# EasyEDA Pro project ProPrj_5VBuck_MP2236_2024-12-14.epro

# Schematic 5VBuck_MP2236
Board Name: Board1; Create Date: 2024-12-13; Page Name: 5VBuck_MP2236_P1; Project Name: 5VBuck_MP2236; Schematic Name: 5VBuck_MP2236; Update Date: 2024-12-13; Company: 嘉立创EDA; Page Size: A4; Version: V1.0
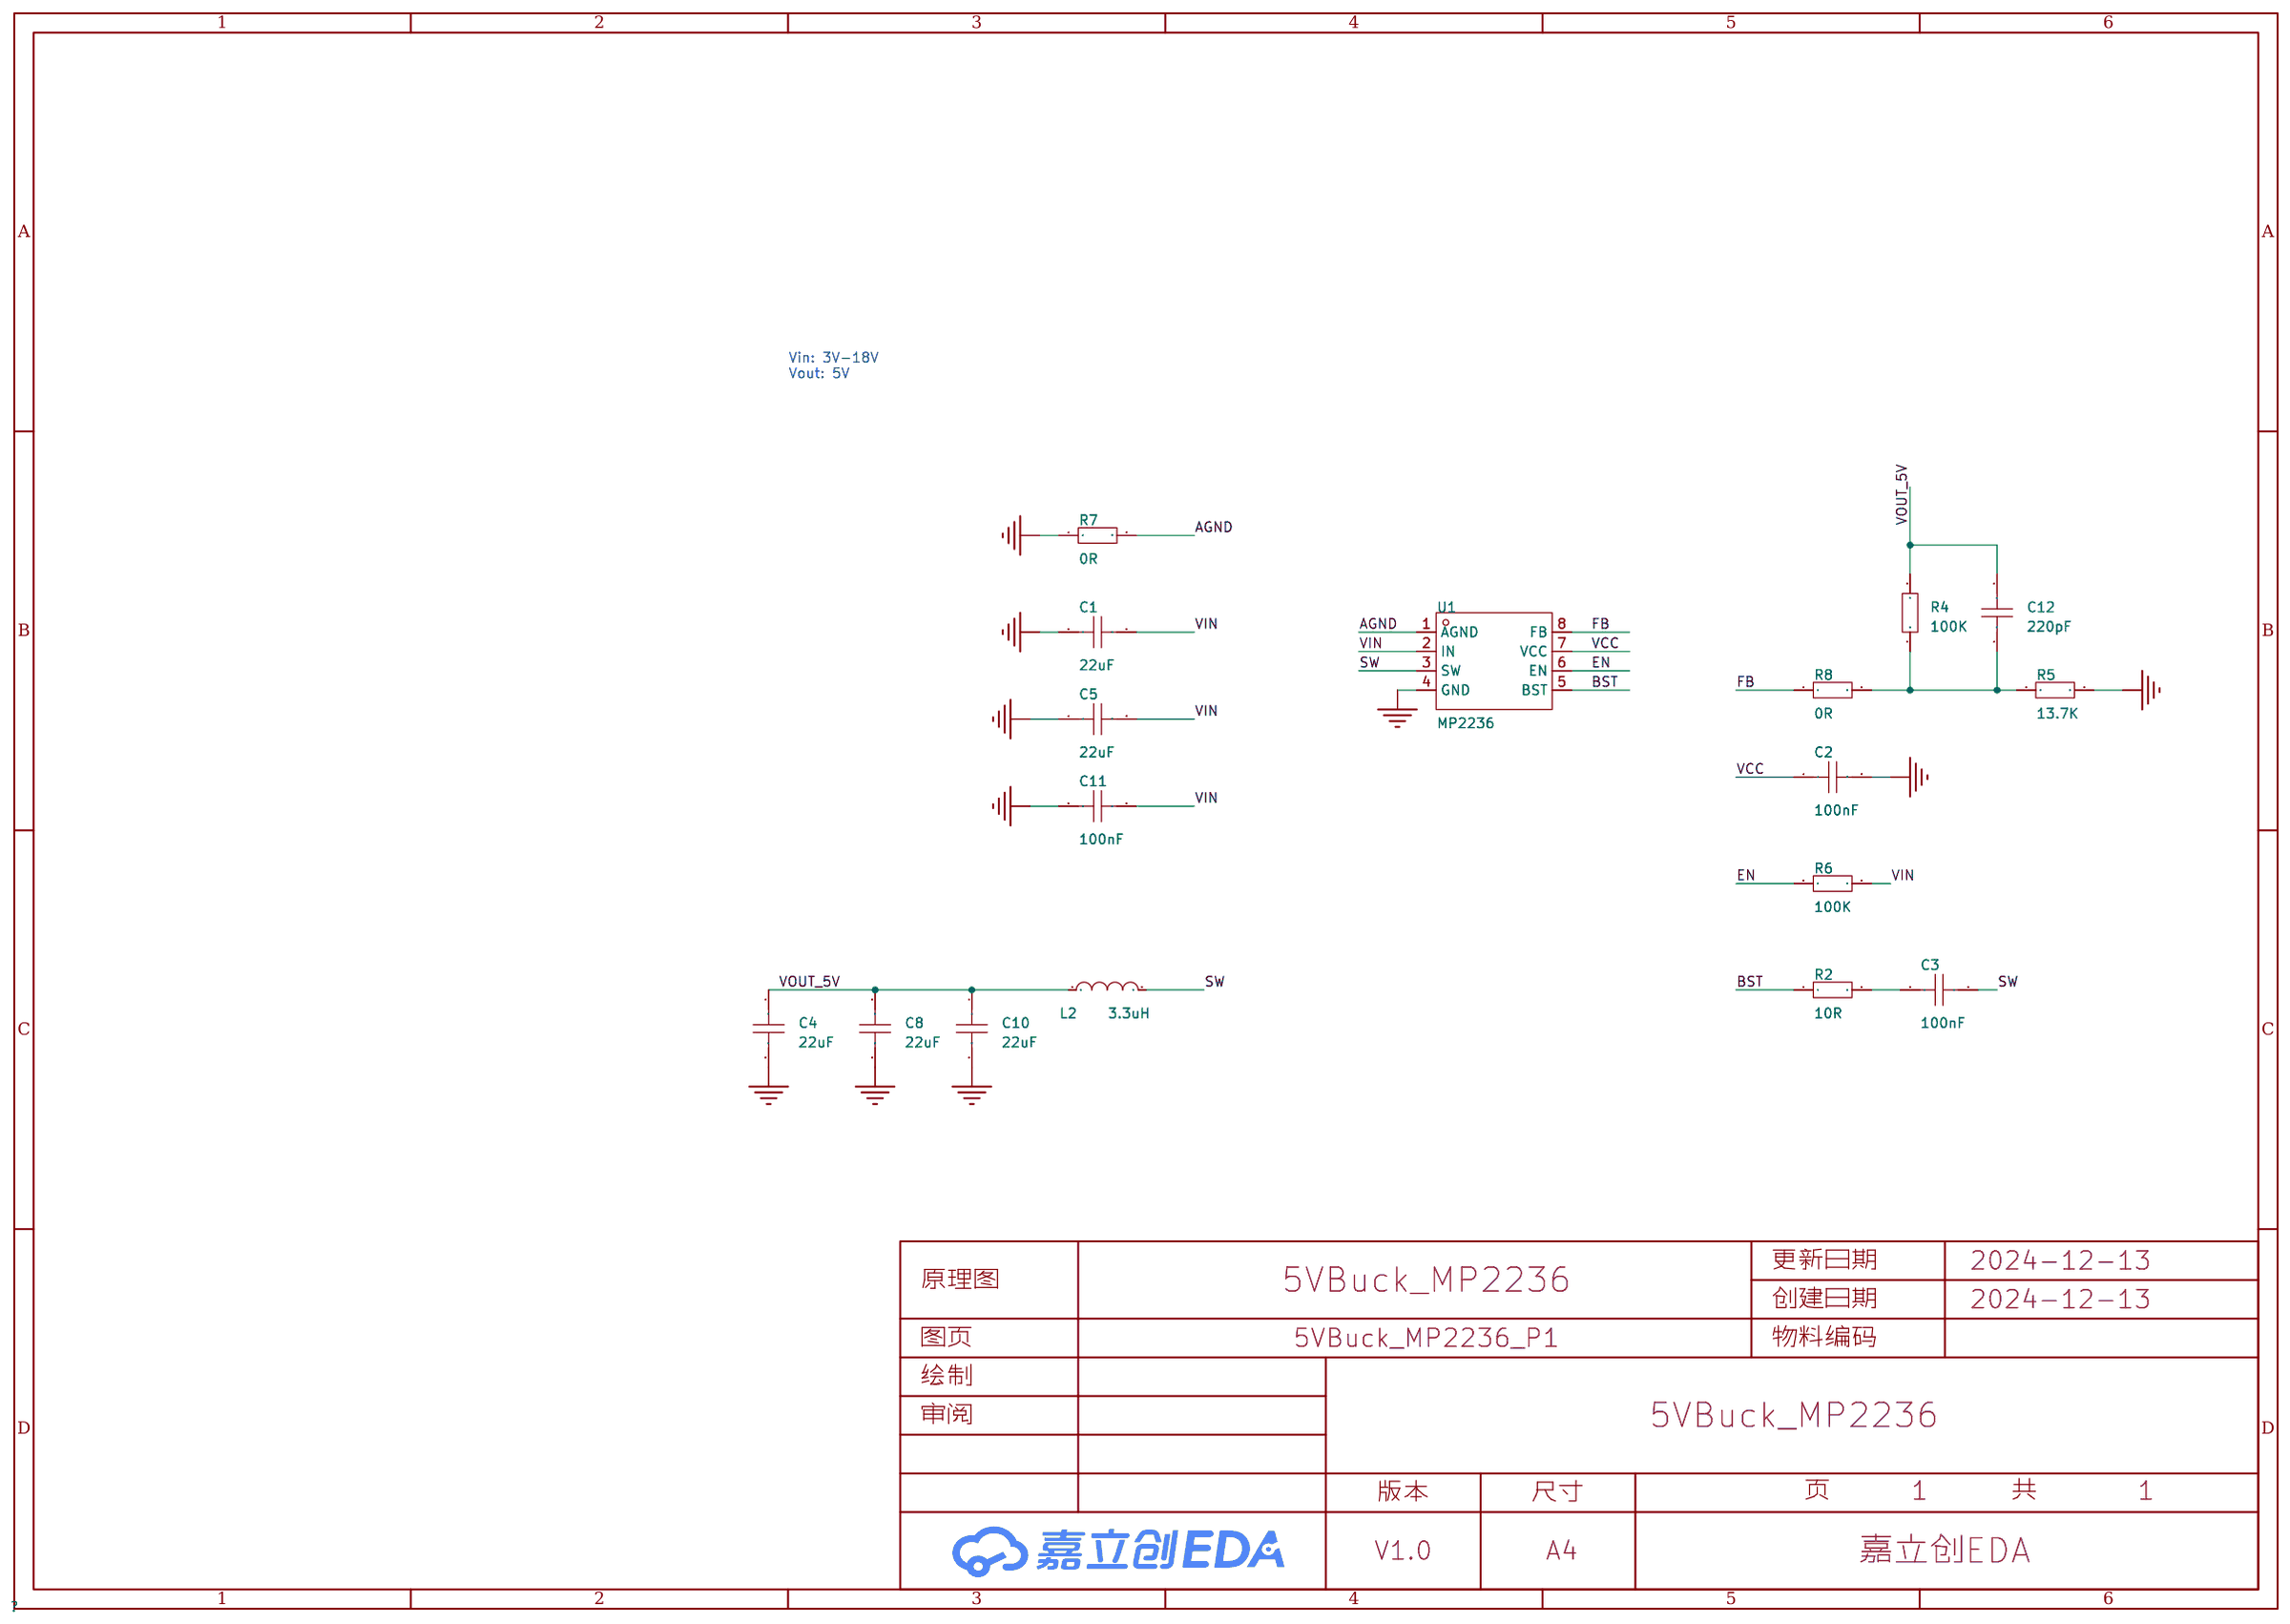
[diagram p0: schematic sheet]

## Parts
C1  22uF  [C0805]
C2  100nF  [C0805]
C3  100nF  [C0805]
C4  22uF  [C0805]
C5  22uF  [C0805]
C8  22uF  [C0805]
C10  22uF  [C0805]
C11  100nF  [C0805]
C12  220pF  [C0805]
L2  3.3uH  [IND-SMD_L7.1-W6.6_MJC-0603T]
R2  10R  [R0805]
R4  100K  [R0805]
R5  13.7K  [R0805]
R6  100K  [R0805]
R7  0R  [R0805]
R8  0R  [R0805]
U1  MP2236  [SOT-23-8_L3.0-W1.7-P0.65-LS2.8-BL]

## Library data of the parts
C1-C5 C8 C10-C12 = CAP_0805: Supplier Footprint: 0805
L2 = CXP0630-5R6M-AG(5.6uh): 电感值:5.6uH;精度:±20%;额定电流:5.5A;饱和电流(Isat):7A;类型:一体成型电感;; LCSC Part Name: 5.6uH ±20% 7A; Supplier Part: C7461360; Manufacturer: DMBJ(振宝佳); Supplier Footprint: 0630; Datasheet: https://atta.szlcsc.com/upload/public/pdf/source/20230706/7F3A5B39C5AD80A91C9FA782B54A296B.pdf; Supplier: LCSC; Tolerance: ±20%; Rated Current: 5.5A; Saturation Current (Isat): 7A; DC Resistance (DCR): 42mΩ; Type: 一体成型电感
R2 R4-R8 = Res_0805: Supplier Footprint: 0805
U1 = MP2236: Supplier Part: C9900030582; Supplier Footprint: SOT23-8; JLCPCB Part Class: 扩展库; Supplier: LCSC

## Nets
AGND: R7.2 U1.1(AGND)
GND: C1.1 C2.2 C4.2 C5.1 C8.2 C10.2 C11.1 R5.2 R7.1 U1.4(GND)
VCC: C2.1 U1.7(VCC)
VIN: C1.2 C5.2 C11.2 R6.1 U1.2(IN)
BST: R2.1 U1.5(BST)
EN: R6.2 U1.6(EN)
FB: R8.1 U1.8(FB)
SW: C3.2 L2.2 U1.3(SW)
VOUT_5V: C4.1 C8.1 C10.1 C12.2 L2.1 R4.2
$C3_1: C3.1 R2.2
$C12_1: C12.1 R4.1 R5.1 R8.2

## Notes on the sheet
- Vin: 3V-18V
  Vout: 5V

# Board 5VBuck_MP2236_PCB
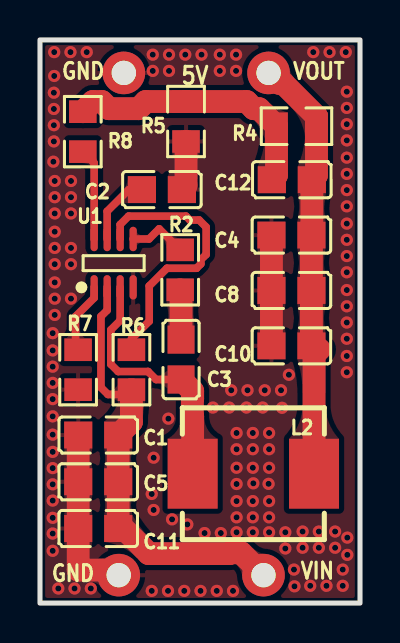
[diagram p1: board, top side]
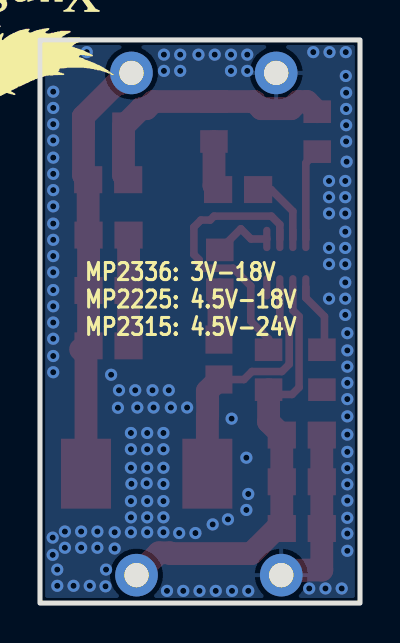
[diagram p2: board, bottom side, seen from below]

Outline 16 x 28.19 mm; copper layers: Top Layer, Bottom Layer. Coordinates in mm from the lower left corner of the outline.
Outline path: rectangle 0,28.19 16,0
Stack: Top Layer 0.035mm / Dielectric1 1.51mm FR4 er 4.5 / Bottom Layer 0.035mm

## Design rules (mm)
template: JLCPCB Capability(Two Layers Board)
spacing copperThickness1oz (default): track to track 0.102, other pairs 0.152 to 0.3
spacing copperThickness2oz: track to track 0.203, other pairs 0.152 to 0.3
track width copperThickness1oz (default): min 0.127, default 0.254, max 2.54
track width copperThickness2oz: min 0.203, default 0.254, max 2.54
differential pair differentialPair (default): width min 0.127, default 0.254, max 2.54; gap min 0.152, default 0.152
via viaSize (default): diameter min 0.5, default 0.61, max 10; hole min 0.3, default 0.305, max 6.3

## Placement (name value [footprint] x y rotation side)
C1  22uF  [C0805]  2.91 8.41 0 top
C2  100nF  [C0805]  6.1 20.7 0 top
C3  100nF  [C0805]  7.05 12.19 270 top
C4  22uF  [C0805]  12.57 18.42 180 top
C5  22uF  [C0805]  2.91 6.07 0 top
C8  22uF  [C0805]  12.57 15.65 180 top
C10  22uF  [C0805]  12.57 12.88 180 top
C11  100nF  [C0805]  2.91 3.73 0 top
C12  220pF  [C0805]  12.59 21.2 0 top
L2  3.3uH  [IND-SMD_L7.1-W6.6_MJC-0603T]  10.67 6.48 180 top
NOREF  -  [Pad_e1070]  4.19 26.54 0 top
NOREF#2  -  [Pad_e1068]  11.18 1.4 0 top
NOREF#3  -  [Pad_e1071]  11.43 26.54 0 top
NOREF#4  -  [Pad_e1066]  3.94 1.4 0 top
R2  10R  [R0805]  7.01 16.69 270 top
R4  100K  [R0805]  12.83 23.88 0 top
R5  13.7K  [R0805]  7.3 24.11 270 top
R6  100K  [R0805]  4.57 11.68 90 top
R7  0R  [R0805]  1.91 11.68 90 top
R8  0R  [R0805]  2.14 23.6 90 top
U1  MP2236  [SOT-23-8_L3.0-W1.7-P0.65-LS2.8-BL]  3.68 17.02 0 top

## Footprints (pads in the part's own frame, mm; a bottom-side part is the same pattern mirrored in y, then rotated)
C0805
  rect 1.41x1.35 smd: 1(-1,0) 2(1,0)
IND-SMD_L7.1-W6.6_MJC-0603T
  rect 2.5x3.5 smd: 1(-3.035,0) 2(3.035,0)
Pad_e1066
  round 2.134 hole 1.219: 1(0,0)
Pad_e1068
  round 2.134 hole 1.219: 1(0,0)
Pad_e1070
  round 2.134 hole 1.219: 1(0,0)
Pad_e1071
  round 2.134 hole 1.219: 1(0,0)
R0805
  rect 1.133x1.377 smd: 1(-1,0) 2(1,0)
SOT-23-8_L3.0-W1.7-P0.65-LS2.8-BL
  oval 0.364x1.222 smd: 1(-0.975,-1.211) 2(-0.325,-1.211) 3(0.325,-1.211) 4(0.975,-1.211) 5(0.975,1.211) 6(0.325,1.211) 7(-0.325,1.211) 8(-0.975,1.211)

## Nets
AGND: R7.2 U1.1
GND: C1.1 C2.2 C4.2 C5.1 C8.2 C10.2 C11.1 NOREF.1 NOREF#4.1 R5.2 R7.1 U1.4
VCC: C2.1 U1.7
VIN: C1.2 C5.2 C11.2 NOREF#2.1 R6.1 U1.2
$C3_1: C3.1 R2.2
$C12_1: C12.1 R4.1 R5.1 R8.2
BST: R2.1 U1.5
EN: R6.2 U1.6
FB: R8.1 U1.8
SW: C3.2 L2.2 U1.3
VOUT_5V: C4.1 C8.1 C10.1 C12.2 L2.1 NOREF#3.1 R4.2

## Via types
v1: diameter 0.61, hole 0.305, Top Layer to Bottom Layer, 133 vias

## Routing (per net, layer and track width the routed paths; a pad name or vN(x,y) marks a point on that pad's centre or on a via; arc(x,y) is an arc through that point)
AGND: length 3.6
  Top Layer w0.381: R7.2 1.78,12.81 1.78,14.35 2.71,15.28 U1.1
GND: length 16.9
  Top Layer w1.143: NOREF#4.1 3.68,1.65 1.91,1.65 C11.1 C5.1 C1.1 ; R5.2 7.3,20.91 C2.2 ; C4.2 C8.2 C10.2
  vias: v1(0.71,27.58) v1(0.71,26.39) v1(0.69,25.55) v1(0.69,24.74) v1(0.69,23.93) v1(0.69,23.11) v1(0.67,22.1) v1(0.63,13.51) v1(0.63,12.65) v1(0.63,11.84) v1(0.63,11.02) v1(0.63,10.21) v1(0.63,9.35) v1(0.63,8.43) v1(0.63,7.57) v1(0.63,6.76) v1(0.63,5.94) v1(0.63,5.13) v1(0.63,4.27) v1(0.63,3.48) v1(0.63,2.62) v1(0.74,21.13) v1(0.74,20.32) v1(0.74,19.51) v1(0.74,18.59) v1(0.74,17.78) v1(0.74,16.97) v1(0.74,16.05) v1(0.74,15.24) v1(0.74,14.43) v1(0.91,0.73) v1(1.52,27.58) v1(1.55,21.13) v1(1.55,20.32) v1(1.55,19.51) v1(1.55,17.78) v1(1.55,16.97) v1(1.55,15.24) v1(1.73,0.73) v1(2.34,27.58) v1(2.54,0.73) v1(5.59,5.46) v1(5.59,0.61) v1(5.64,27.46) v1(5.64,26.64) v1(5.68,7.28) v1(5.68,4.66) v1(6.42,9.23) v1(6.4,0.61) v1(6.45,27.46) v1(6.45,26.64) v1(6.6,4.19) v1(7.21,0.61) v1(7.26,27.46) v1(7.37,3.94) v1(8.08,27.46) v1(8.03,0.61) v1(8.23,3.5) v1(8.65,9.79) v1(8.84,0.61) v1(8.99,27.46) v1(8.99,26.64) v1(9.04,3.5) v1(9.46,9.79) v1(9.56,10.66) v1(9.65,0.61) v1(9.8,27.46) v1(9.8,26.64) v1(9.83,8.52) v1(9.83,7.7) v1(9.83,6.77) v1(9.83,5.96) v1(9.83,5.1) v1(9.83,4.29) v1(9.83,3.54) v1(10.32,9.79) v1(10.38,10.66) v1(10.64,8.52) v1(10.64,7.7) v1(10.64,6.77) v1(10.67,5.99) v1(10.64,5.1) v1(10.64,4.29) v1(10.64,3.54) v1(11.14,9.79) v1(11.24,10.66) v1(11.46,8.52) v1(11.46,7.7) v1(11.46,6.77) v1(11.43,5.97) v1(11.46,5.1) v1(11.46,4.29) v1(11.46,3.54) v1(12.05,10.66) v1(12.1,9.78) v1(12.27,3.54) v1(12.27,2.73) v1(12.45,11.43) v1(12.7,1.68) v1(12.73,0.84) v1(13.13,3.58) v1(13.13,2.77) v1(13.51,0.86) v1(13.66,27.58) v1(13.94,3.58) v1(13.94,2.77) v1(14.33,0.86) v1(14.48,27.58) v1(14.76,3.58) v1(14.76,2.77) v1(15.14,1.68) v1(15.14,0.86) v1(15.29,27.58) v1(15.34,25.6) v1(15.34,24.79) v1(15.34,23.98) v1(15.34,23.16) v1(15.34,22.3) v1(15.34,21.49) v1(15.34,20.68) v1(15.34,19.86) v1(15.34,19) v1(15.34,18.19) v1(15.34,17.37) v1(15.34,16.56) v1(15.34,15.67) v1(15.34,14.86) v1(15.34,14.05) v1(15.34,13.23) v1(15.34,12.37) v1(15.34,11.56) v1(15.37,3.28) v1(15.37,2.41)
VCC: length 3.6
  Top Layer w0.381: C2.1 4.44,20.7 3.36,19.61 U1.7
VIN: length 22.1
  Top Layer w0.381: R6.1 4.33,10.44 3.4,10.44 3.05,10.8 3.05,14.35 3.36,14.66 U1.2
  Top Layer w1.143: 4.18,3.73 5.44,2.48 9.47,2.48 9.51,2.52 10.06,2.52 NOREF#2.1 ; C11.2 C5.2 C1.2 4.57,9.07 R6.1
$C3_1: length 2.5
  Top Layer w1.143: C3.1 7.05,15.64 R2.2
$C12_1: length 13.5
  Top Layer w1.143: C12.1 11.83,21.43 R4.1 10.95,24.75 10.69,24.75 10.33,25.11 R5.1 5.29,25.11 4.93,24.75 3.45,24.75 3.09,25.11 2.65,25.11 R8.2
BST: length 3
  Top Layer w0.381: R2.1 5.96,18.74 5.45,18.23 U1.5
EN: length 14
  Top Layer w0.381: U1.6 4.01,18.95 4.43,19.37 7.3,19.37 7.49,19.18 7.96,19.18 8.31,18.83 8.31,17.45 8.04,17.19 8.04,16.98 7.83,16.76 6.35,16.76 5.46,15.88 5.46,14.11 4.57,13.22 R6.2
FB: length 4.6
  Top Layer w0.381: R8.1 2.71,22.03 U1.8
SW: length 12.8
  Top Layer w0.381: U1.3 4.01,14.14 3.54,13.67 3.54,11.96 3.91,11.59 5.4,11.59 5.8,11.19 C3.2
  Top Layer w1.143: C3.2 7.63,10.61 7.63,10.23 7.62,10.22 7.62,9.36 7.63,9.35 L2.2
VOUT_5V: length 21.2
  Top Layer w1.143: C10.1 C8.1 C4.1 13.59,18.44 C12.2 13.83,21.43 R4.2 13.83,24.36 12.16,26.03 11.94,26.03 NOREF#3.1 ; L2.1 13.7,12.43 13.97,12.7

## Copper pours and planes (outline as drawn; the poured copper is in the pictures)
GND on Top Layer: -2.67,30.23 20.32,30.23 20.32,-3.17 -2.67,-3.17
GND on Bottom Layer: -1.4,29.72 18.41,29.72 18.41,-1.91 -1.4,-1.91

Small or netless copper shapes (teardrops, artwork), in the pictures only: 44 on Top Layer

## Text on the board
Bottom Silkscreen Layer: MP2336: 3V-18V / MP2225: 4.5V-18V / MP2315: 4.5V-24V
Top Silkscreen Layer: GND | VOUT | VIN | 5V

# Board 5VBuck_MP2236_PCB_joint
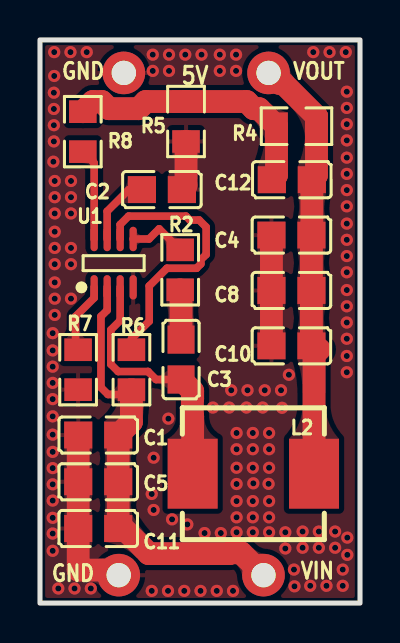
[diagram p3: board, top side]
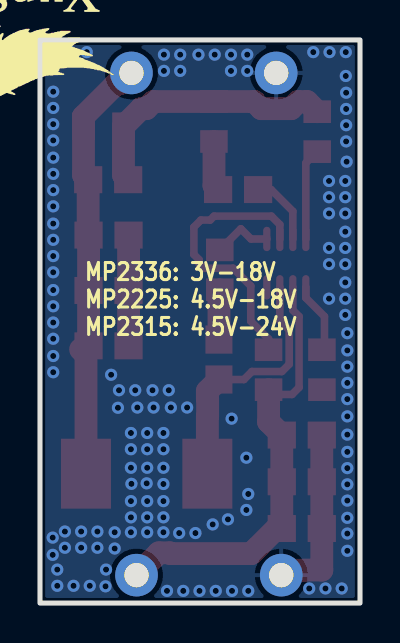
[diagram p4: board, bottom side, seen from below]

Outline 16 x 28.19 mm; copper layers: Top Layer, Bottom Layer. Coordinates in mm from the lower left corner of the outline.
Outline path: rectangle 0,28.19 16,0
Stack: Top Layer 0.035mm / Dielectric1 1.51mm FR4 er 4.5 / Bottom Layer 0.035mm

## Design rules (mm)
template: JLCPCB Capability(Two Layers Board)
spacing copperThickness1oz (default): track to track 0.102, other pairs 0.152 to 0.3
spacing copperThickness2oz: track to track 0.203, other pairs 0.152 to 0.3
track width copperThickness1oz (default): min 0.127, default 0.254, max 2.54
track width copperThickness2oz: min 0.203, default 0.254, max 2.54
differential pair differentialPair (default): width min 0.127, default 0.254, max 2.54; gap min 0.152, default 0.152
via viaSize (default): diameter min 0.5, default 0.61, max 10; hole min 0.3, default 0.305, max 6.3

## Placement (name value [footprint] x y rotation side)
C1  22uF  [C0805]  2.91 8.41 0 top
C2  100nF  [C0805]  6.1 20.7 0 top
C3  100nF  [C0805]  7.05 12.19 270 top
C4  22uF  [C0805]  12.57 18.42 180 top
C5  22uF  [C0805]  2.91 6.07 0 top
C8  22uF  [C0805]  12.57 15.65 180 top
C10  22uF  [C0805]  12.57 12.88 180 top
C11  100nF  [C0805]  2.91 3.73 0 top
C12  220pF  [C0805]  12.59 21.2 0 top
L2  3.3uH  [IND-SMD_L7.1-W6.6_MJC-0603T]  10.67 6.48 180 top
NOREF  -  [Pad_e1071]  11.43 26.54 0 top
NOREF#2  -  [Pad_e1070]  4.19 26.54 0 top
NOREF#3  -  [Pad_e1066]  3.94 1.4 0 top
NOREF#4  -  [Pad_e1068]  11.18 1.4 0 top
R2  10R  [R0805]  7.01 16.69 270 top
R4  100K  [R0805]  12.83 23.88 0 top
R5  13.7K  [R0805]  7.3 24.11 270 top
R6  100K  [R0805]  4.57 11.68 90 top
R7  0R  [R0805]  1.91 11.68 90 top
R8  0R  [R0805]  2.14 23.6 90 top
U1  MP2236  [SOT-23-8_L3.0-W1.7-P0.65-LS2.8-BL]  3.68 17.02 0 top

## Footprints (pads in the part's own frame, mm; a bottom-side part is the same pattern mirrored in y, then rotated)
C0805
  rect 1.41x1.35 smd: 1(-1,0) 2(1,0)
IND-SMD_L7.1-W6.6_MJC-0603T
  rect 2.5x3.5 smd: 1(-3.035,0) 2(3.035,0)
Pad_e1066
  round 2.134 hole 1.219: 1(0,0)
Pad_e1068
  round 2.134 hole 1.219: 1(0,0)
Pad_e1070
  round 2.134 hole 1.219: 1(0,0)
Pad_e1071
  round 2.134 hole 1.219: 1(0,0)
R0805
  rect 1.133x1.377 smd: 1(-1,0) 2(1,0)
SOT-23-8_L3.0-W1.7-P0.65-LS2.8-BL
  oval 0.364x1.222 smd: 1(-0.975,-1.211) 2(-0.325,-1.211) 3(0.325,-1.211) 4(0.975,-1.211) 5(0.975,1.211) 6(0.325,1.211) 7(-0.325,1.211) 8(-0.975,1.211)

## Nets
AGND: R7.2 U1.1
GND: C1.1 C2.2 C4.2 C5.1 C8.2 C10.2 C11.1 NOREF#2.1 NOREF#3.1 R5.2 R7.1 U1.4
VCC: C2.1 U1.7
VIN: C1.2 C5.2 C11.2 NOREF#4.1 R6.1 U1.2
$C3_1: C3.1 R2.2
$C12_1: C12.1 R4.1 R5.1 R8.2
BST: R2.1 U1.5
EN: R6.2 U1.6
FB: R8.1 U1.8
SW: C3.2 L2.2 U1.3
VOUT_5V: C4.1 C8.1 C10.1 C12.2 L2.1 NOREF.1 R4.2

## Via types
v1: diameter 0.61, hole 0.305, Top Layer to Bottom Layer, 133 vias

## Routing (per net, layer and track width the routed paths; a pad name or vN(x,y) marks a point on that pad's centre or on a via; arc(x,y) is an arc through that point)
AGND: length 3.6
  Top Layer w0.381: U1.1 2.71,15.28 1.78,14.35 1.78,12.81 R7.2
GND: length 16.9
  Top Layer w1.143: C2.2 7.3,20.91 R5.2 ; C10.2 C8.2 C4.2 ; C1.1 C5.1 C11.1 1.91,1.65 3.68,1.65 NOREF#3.1
  vias: v1(0.71,27.58) v1(0.71,26.39) v1(0.69,25.55) v1(0.69,24.74) v1(0.69,23.93) v1(0.69,23.11) v1(0.67,22.1) v1(0.63,13.51) v1(0.63,12.65) v1(0.63,11.84) v1(0.63,11.02) v1(0.63,10.21) v1(0.63,9.35) v1(0.63,8.43) v1(0.63,7.57) v1(0.63,6.76) v1(0.63,5.94) v1(0.63,5.13) v1(0.63,4.27) v1(0.63,3.48) v1(0.63,2.62) v1(0.74,21.13) v1(0.74,20.32) v1(0.74,19.51) v1(0.74,18.59) v1(0.74,17.78) v1(0.74,16.97) v1(0.74,16.05) v1(0.74,15.24) v1(0.74,14.43) v1(0.91,0.73) v1(1.52,27.58) v1(1.55,21.13) v1(1.55,20.32) v1(1.55,19.51) v1(1.55,17.78) v1(1.55,16.97) v1(1.55,15.24) v1(1.73,0.73) v1(2.34,27.58) v1(2.54,0.73) v1(5.59,5.46) v1(5.59,0.61) v1(5.64,27.46) v1(5.64,26.64) v1(5.68,7.28) v1(5.68,4.66) v1(6.42,9.23) v1(6.4,0.61) v1(6.45,27.46) v1(6.45,26.64) v1(6.6,4.19) v1(7.21,0.61) v1(7.26,27.46) v1(7.37,3.94) v1(8.08,27.46) v1(8.03,0.61) v1(8.23,3.5) v1(8.65,9.79) v1(8.84,0.61) v1(8.99,27.46) v1(8.99,26.64) v1(9.04,3.5) v1(9.46,9.79) v1(9.56,10.66) v1(9.65,0.61) v1(9.8,27.46) v1(9.8,26.64) v1(9.83,8.52) v1(9.83,7.7) v1(9.83,6.77) v1(9.83,5.96) v1(9.83,5.1) v1(9.83,4.29) v1(9.83,3.54) v1(10.32,9.79) v1(10.38,10.66) v1(10.64,8.52) v1(10.64,7.7) v1(10.64,6.77) v1(10.67,5.99) v1(10.64,5.1) v1(10.64,4.29) v1(10.64,3.54) v1(11.14,9.79) v1(11.24,10.66) v1(11.46,8.52) v1(11.46,7.7) v1(11.46,6.77) v1(11.43,5.97) v1(11.46,5.1) v1(11.46,4.29) v1(11.46,3.54) v1(12.05,10.66) v1(12.1,9.78) v1(12.27,3.54) v1(12.27,2.73) v1(12.45,11.43) v1(12.7,1.68) v1(12.73,0.84) v1(13.13,3.58) v1(13.13,2.77) v1(13.51,0.86) v1(13.66,27.58) v1(13.94,3.58) v1(13.94,2.77) v1(14.33,0.86) v1(14.48,27.58) v1(14.76,3.58) v1(14.76,2.77) v1(15.14,1.68) v1(15.14,0.86) v1(15.29,27.58) v1(15.34,25.6) v1(15.34,24.79) v1(15.34,23.98) v1(15.34,23.16) v1(15.34,22.3) v1(15.34,21.49) v1(15.34,20.68) v1(15.34,19.86) v1(15.34,19) v1(15.34,18.19) v1(15.34,17.37) v1(15.34,16.56) v1(15.34,15.67) v1(15.34,14.86) v1(15.34,14.05) v1(15.34,13.23) v1(15.34,12.37) v1(15.34,11.56) v1(15.37,3.28) v1(15.37,2.41)
VCC: length 3.6
  Top Layer w0.381: C2.1 4.44,20.7 3.36,19.61 U1.7
VIN: length 22.1
  Top Layer w0.381: U1.2 3.36,14.66 3.05,14.35 3.05,10.8 3.4,10.44 4.33,10.44 R6.1
  Top Layer w1.143: 4.18,3.73 5.44,2.48 9.47,2.48 9.51,2.52 10.06,2.52 NOREF#4.1 ; R6.1 4.57,9.07 C1.2 C5.2 C11.2
$C3_1: length 2.5
  Top Layer w1.143: R2.2 7.05,15.64 C3.1
$C12_1: length 13.5
  Top Layer w1.143: R8.2 2.65,25.11 3.09,25.11 3.45,24.75 4.93,24.75 5.29,25.11 R5.1 10.33,25.11 10.69,24.75 10.95,24.75 R4.1 11.83,21.43 C12.1
BST: length 3
  Top Layer w0.381: R2.1 5.96,18.74 5.45,18.23 U1.5
EN: length 14
  Top Layer w0.381: R6.2 4.57,13.22 5.46,14.11 5.46,15.88 6.35,16.76 7.83,16.76 8.04,16.98 8.04,17.19 8.31,17.45 8.31,18.83 7.96,19.18 7.49,19.18 7.3,19.37 4.43,19.37 4.01,18.95 U1.6
FB: length 4.6
  Top Layer w0.381: U1.8 2.71,22.03 R8.1
SW: length 12.8
  Top Layer w0.381: C3.2 5.8,11.19 5.4,11.59 3.91,11.59 3.54,11.96 3.54,13.67 4.01,14.14 U1.3
  Top Layer w1.143: C3.2 7.63,10.61 7.63,10.23 7.62,10.22 7.62,9.36 7.63,9.35 L2.2
VOUT_5V: length 21.2
  Top Layer w1.143: 13.97,12.7 13.7,12.43 L2.1 ; C10.1 C8.1 C4.1 13.59,18.44 C12.2 13.83,21.43 R4.2 13.83,24.36 12.16,26.03 11.94,26.03 NOREF.1

## Copper pours and planes (outline as drawn; the poured copper is in the pictures)
GND on Top Layer: -2.67,30.23 20.32,30.23 20.32,-3.17 -2.67,-3.17
GND on Bottom Layer: -1.4,29.72 18.41,29.72 18.41,-1.91 -1.4,-1.91

Small or netless copper shapes (teardrops, artwork), in the pictures only: 44 on Top Layer

## Text on the board
Bottom Silkscreen Layer: MP2336: 3V-18V / MP2225: 4.5V-18V / MP2315: 4.5V-24V
Top Silkscreen Layer: GND | VOUT | VIN | 5V
